# EAGLE schematic Simple-Charger-LiIon-OpampBased-LM324-prev (EAGLE 7.6.0)
Simple LM358 OP-AMP based USB Li-ion charger https://www.circuitsdiy.com/simple-lm358-op-amp-based-usb-li-ion-charger/ https://www.circuitsdiy.com/usb-li-ion-charger-revision/
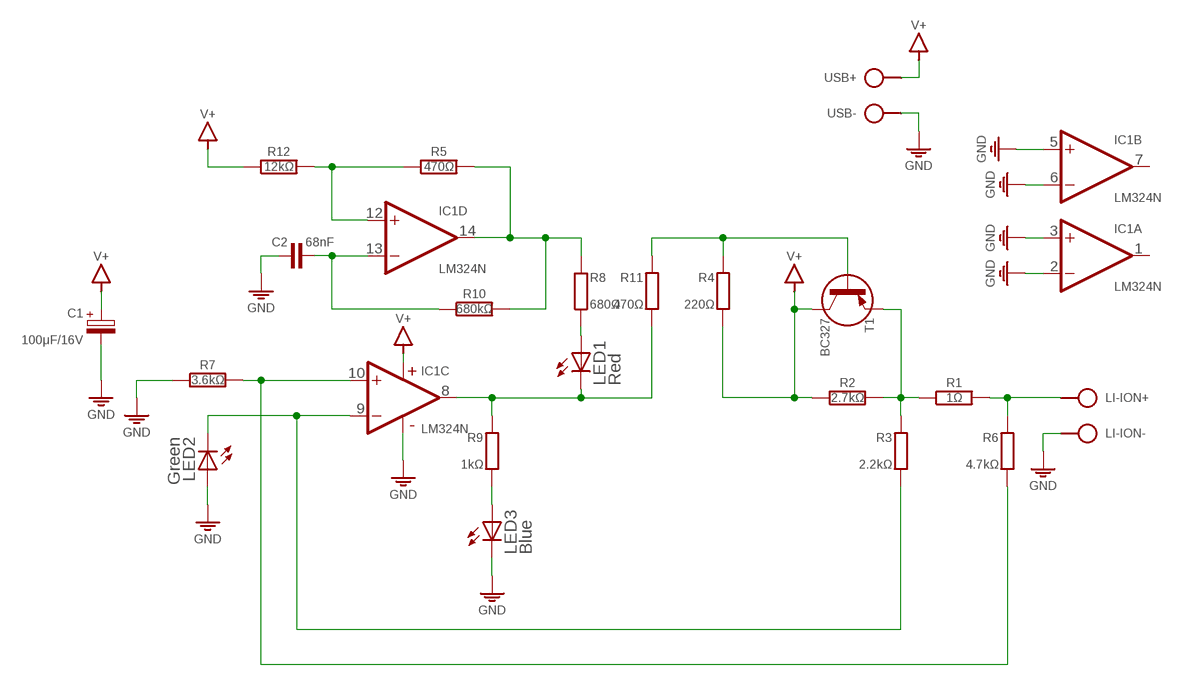
[diagram p0: schematic, sheet 1]

## Parts
C1  100μF/16V  CPOLE2,5-5/V  [E2,5-5/V]
C2  68nF  C-H050-020X044/V  [C050-020X044/V]
IC1  LM324N  [DIL14]
LED1  Red  LED3MM  [LED3MM]
LED2  Green  LED3MM  [LED3MM]
LED3  Blue  LED3MM  [LED3MM]
LI-ION  SPAD+-+-  [SPAD+-]
R1  1Ω  R-H0204/10-V  [0204/10-V]
R2  2.7kΩ  R-H0204/10-V  [0204/10-V]
R3  2.2kΩ  R0204/10-V  [0204/10-V]
R4  220Ω  R0204/10  [0204/10]
R5  470Ω  R-H0204/10  [0204/10]
R6  4.7kΩ  R0204/10-V  [0204/10-V]
R7  3.6kΩ  R-H0204/10-V  [0204/10-V]
R8  680Ω  R0204/10  [0204/10]
R9  1kΩ  R0204/10-V  [0204/10-V]
R10  680kΩ  R-H0204/2V  [0204/2V]
R11  470Ω  R0204/10-V  [0204/10-V]
R12  12kΩ  R-H0204/10-V  [0204/10-V]
T1  BC327  [TO92]
USB  SPAD+--+  [SPAD-+]

## Nets
GND: C1.- C2.1 IC1.2(A:-IN) IC1.3(A:+IN) IC1.5(B:+IN) IC1.6(B:-IN) IC1.11(P:V-) LED2.A LED3.K(C) LI-ION.1 R7.1 USB.1
N$1: IC1.12(D:+IN) R5.1 R12.2
N$2: IC1.14(D:OUT) R5.2 R8.1 R10.2
N$3: C2.2 IC1.13(D:-IN) R10.1
N$5: IC1.9(C:-IN) LED2.K(C) R3.2
N$6: LED3.A R9.2
N$7: IC1.8(C:OUT) LED1.K(C) R9.1 R11.2
N$8: LED1.A R8.2
N$9: R4.1 R11.1 T1.2(B)
N$11: R1.1 R2.2 R3.1 T1.3(E)
N$12: LI-ION.2 R1.2 R6.1
N$13: IC1.10(C:+IN) R6.2 R7.2
V+: C1.+ IC1.4(P:V+) R2.1 R4.2 R12.1 T1.1(C) USB.2
Unconnected: IC1.1(A:OUT) IC1.7(B:OUT)

## Library data of the parts
C1 = c:CPOL: POLARIZED CAPACITOR, European symbol
C2 = c:C-H
IC1 = ic:LM324: Single Supply Quad Operational Amplifiers http://www.ti.com/lit/ds/symlink/lm324.pdf
LED1-LED3 = led:LED: LED OSRAM: - CHIPLED LG R971, LG N971, LY N971, LG Q971, LY Q971, LO R971, LY R971 LH N974, LH R974 LS Q976, LO Q976, LY Q976 LO Q996 - Hyper CHIPLED LW Q18S LB Q993, LB Q99A, LB R99A - SideLED LS A670, LO A670, LY A670, LG A670, LP A670 LB A673, LV A673, LT A673, LW A673 LH A674 LY A675 LS A676, LA A676, LO A676, LY A676, LW A676 LS A679, LY A679, LG A679 - Hyper Micro SIDELED@@ LS Y876, LA Y876, LO Y876, LY Y876 LT Y87S - SmartLED LW L88C, LW L88S LB L89C, LB L89S, LG L890 LS L89K, LO L89K, LY L89K LS L896, LA L896, LO L896, LY L896 - TOPLED LS T670, LO T670, LY T670, LG T670, LP T670 LSG T670, LSP T670, LSY T670, LOP T670, LYG T670 LG T671, LOG T671, LSG T671 LB T673, LV T673, LT T673, LW T673 LH T674 LS T676, LA T676, LO T676, LY T676, LB T676, LH T676, LSB T676, LW T676 LB T67C, LV T67C, LT T67C, LS T67K, LO T67K, LY T67K, LW E67C LS E67B, LA E67B, LO E67B, LY E67B, LB E67C, LV E67C, LT E67C LW T67C LS T679, LY T679, LG T679 LS T770, LO T770, LY T770, LG T770, LP T770 LB T773, LV T773, LT T773, LW T773 LH T774 LS E675, LA E675, LY E675, LS T675 LS T776, LA T776, LO T776, LY T776, LB T776 LHGB T686 LT T68C, LB T68C - Hyper Mini TOPLED@@ LB M676 - Mini TOPLED Santana@@ LG M470 LS M47K, LO M47K, LY M47K Source: http://www.osram.convergy.de LUXEON: - LUMILED@@ LXK2-PW12-R00, LXK2-PW12-S00, LXK2-PW14-U00, LXK2-PW14-V00 LXK2-PM12-R00, LXK2-PM12-S00, LXK2-PM14-U00 LXK2-PE12-Q00, LXK2-PE12-R00, LXK2-PE12-S00, LXK2-PE14-T00, LXK2-PE14-U00 LXK2-PB12-K00, LXK2-PB12-L00, LXK2-PB12-M00, LXK2-PB14-N00, LXK2-PB14-P00, LXK2-PB14-Q00 LXK2-PR12-L00, LXK2-PR12-M00, LXK2-PR14-Q00, LXK2-PR14-R00 LXK2-PD12-Q00, LXK2-PD12-R00, LXK2-PD12-S00 LXK2-PH12-R00, LXK2-PH12-S00 LXK2-PL12-P00, LXK2-PL12-Q00, LXK2-PL12-R00 Source: www.luxeon.com KINGBRIGHT: KA-3528ASYC Source: www.kingbright.com
LI-ION USB = pad:SPAD+-
R1 R2 R5 R7 R10 R12 = r:R-H
R3 R4 R6 R8 R9 R11 = r:R: RESISTOR, European symbol
T1 = t:BC327